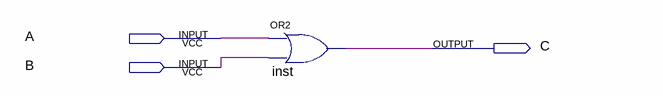
[diagram p0: schematic sheet]
// Quartus schematic orgate1.bdf as structural Verilog: 1 symbols, 3 pins
module orgate1 (
  input  A,
  input  B,
  output C
);

  or inst (C, A, B);
endmodule
